# Altium project KIT_DEV.PrjPcb
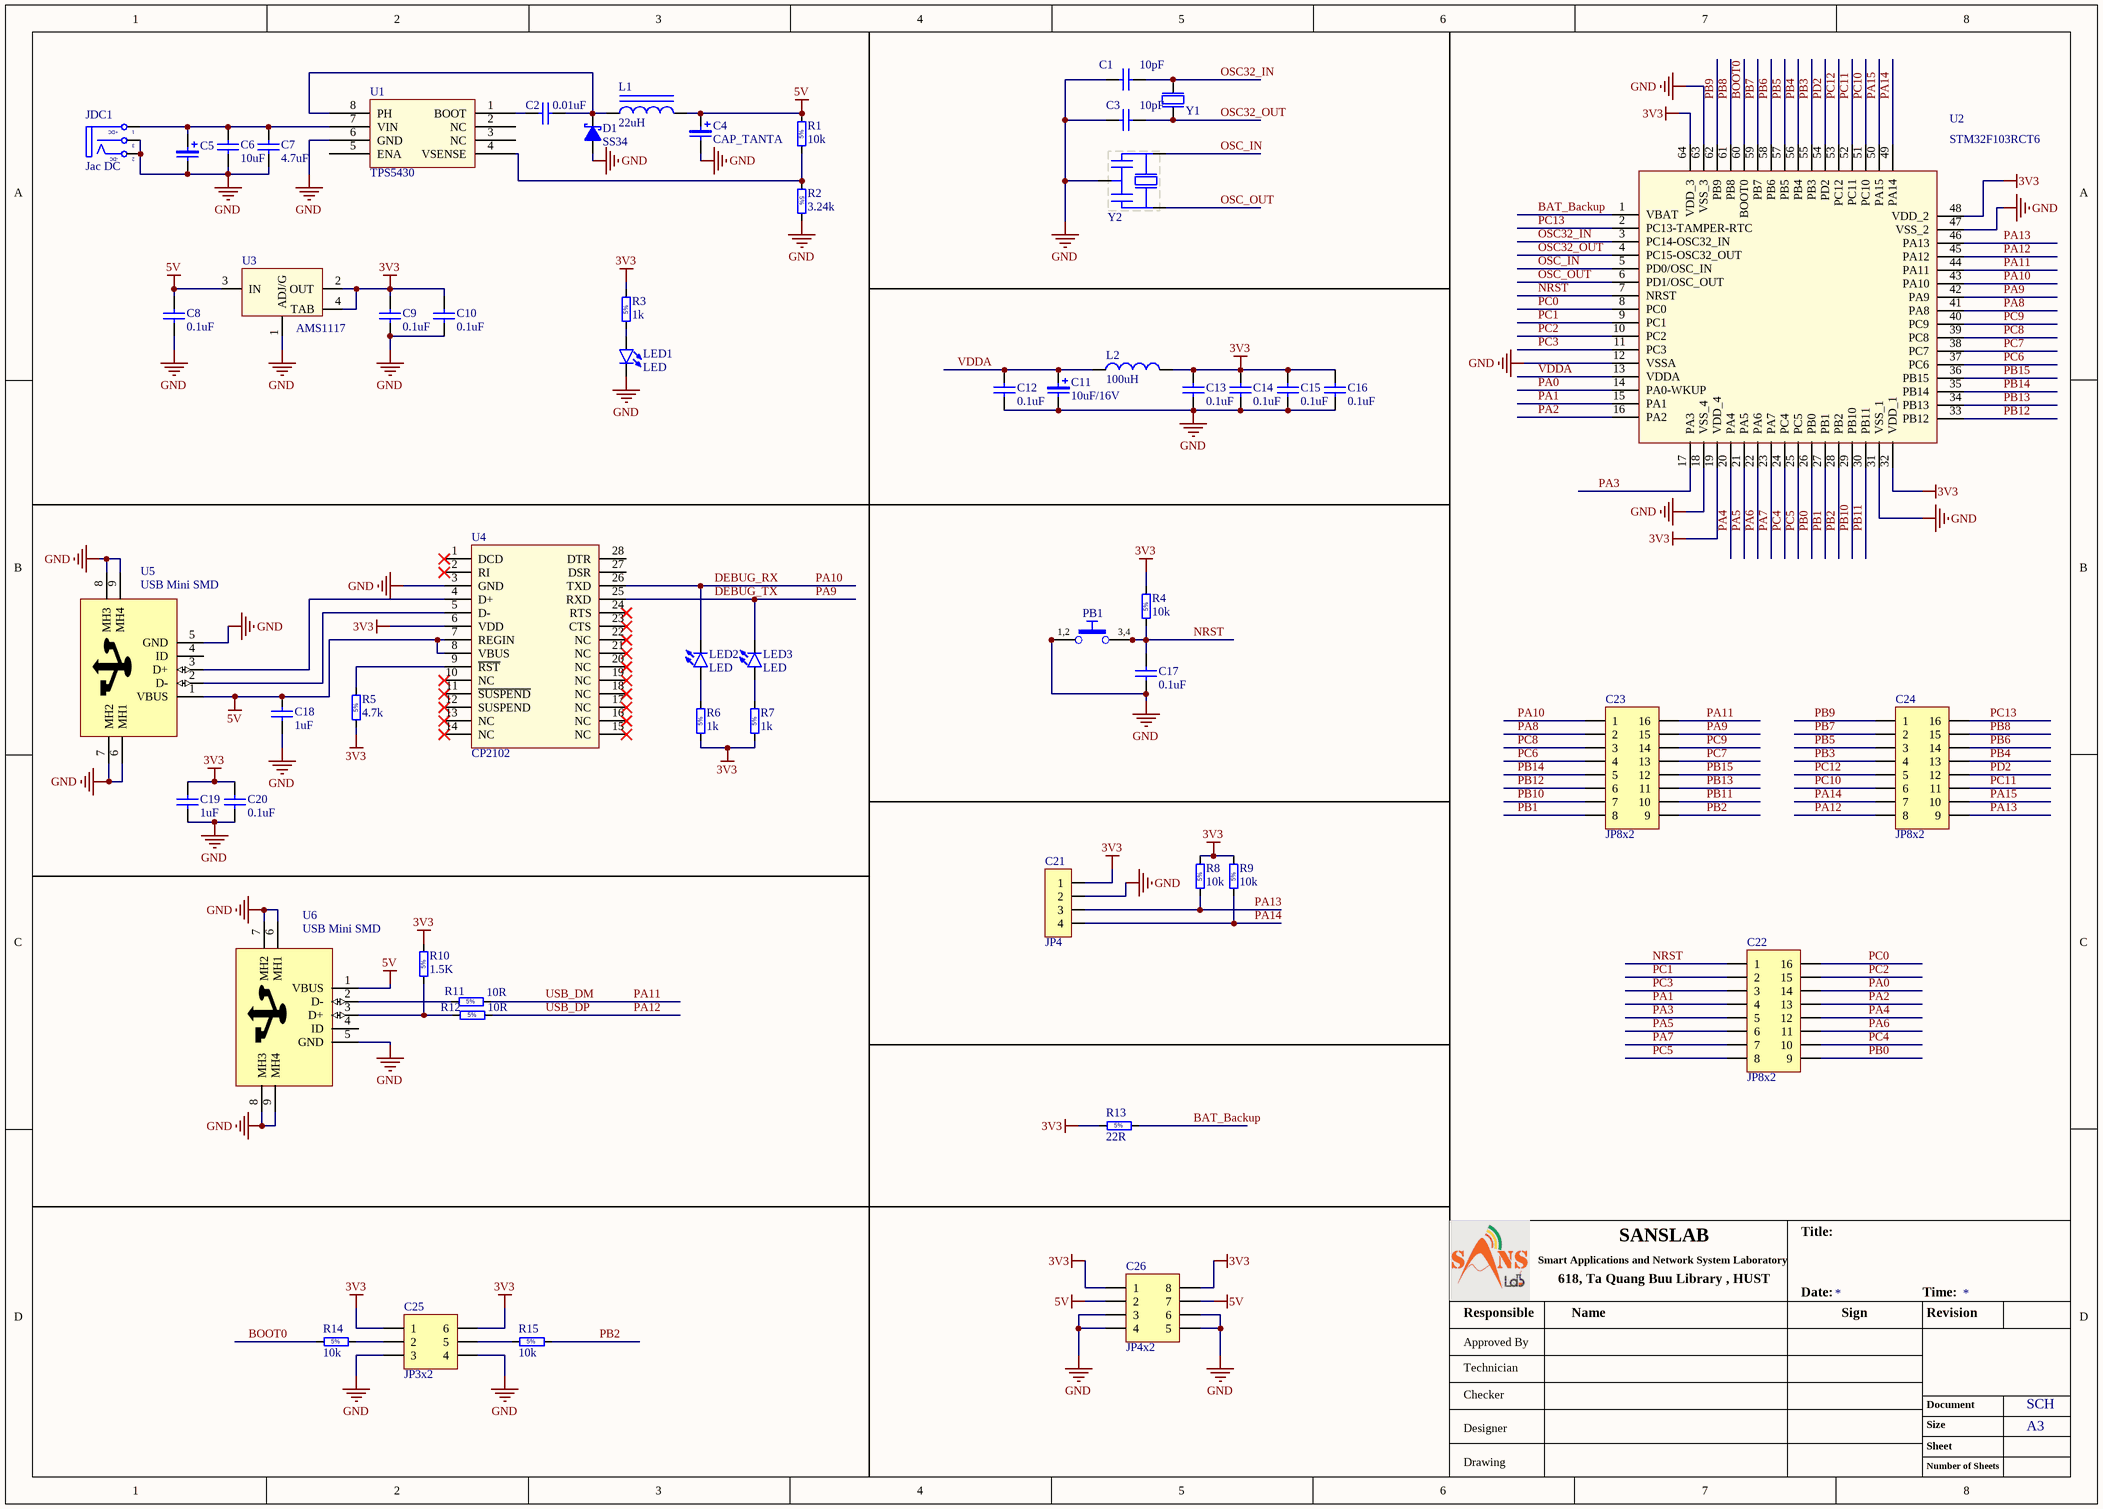
[diagram p0: KIT_STM32.SchDoc]
1 sheet, 57 parts. Net scope: global (net labels, ports and power ports of the same name join across sheets).
Board file: KIT.PcbDoc

## Sheet KIT_STM32.SchDoc
size A3; Organization: Altium Limited; Address1: L3, 12a Rodborough Rd; Address2: Frenchs Forest; Address3: NSW; Address4: Australia 2086

### Parts
C1  10pF  [CAPC1608X87N]
C2  0.01uF  [CAPC1608X06N]
C3  10pF  [CAPC1608X87N]
C4  CAP_TANTA  [Tantalum]
C5  220uF/16V  [CAP_ELEC_6.3]  (value not drawn)
C6  10uF  [CAPC3216X06N]
C7  4.7uF  [CAPC3216X06N]
C8  0.1uF  [CAPC1608X87N]
C9  0.1uF  [CAPC1608X87N]
C10  0.1uF  [CAPC1608X87N]
C11  10uF/16V  [CAPMP_3216_CASE_A]
C12  0.1uF  [CAPC1608X87N]
C13  0.1uF  [CAPC1608X87N]
C14  0.1uF  [CAPC1608X87N]
C15  0.1uF  [CAPC1608X87N]
C16  0.1uF  [CAPC1608X87N]
C17  0.1uF  [CAPC1608X87N]
C18  1uF  [CAPC1608X87N]
C19  1uF  [CAPC1608X87N]
C20  0.1uF  [CAPC1608X87N]
C21  JP4  [JP4-D1C]
C22  JP8x2  [JP8-C2T]
C23  JP8x2  [JP8-C2T]
C24  JP8x2  [JP8-C2T]
C25  JP3x2  [JP3-D2T]
C26  JP4x2  [JP4-D2T]
D1  SS34  [SS34]
JDC1  Jac DC  [DC-IN]
L1  22uH  [INDUCTOR]
L2  100uH  [INDUC_0805_2012X95N]
LED1  LED  [LED-0805-BLUE]
LED2  LED  [LED-0805-BLUE]
LED3  LED  [LED-0805-BLUE]
PB1  Push Button  [PB_TYCO_FSM6JSMA]  (value not drawn)
R1  10k  [RESC1608X55N]
R2  3.24k  [RESC1608X55N]
R3  1k  [RESC1608X55N]
R4  10k  [RESC1608X55N]
R5  4.7k  [RESC1608X55N]
R6  1k  [RESC1608X55N]
R7  1k  [RESC1608X55N]
R8  10k  [RESC1608X55N]
R9  10k  [RESC1608X55N]
R10  1.5K  [RESC1608X55N]
R11  10R  [RESC1608X55N]
R12  10R  [RESC1608X55N]
R13  22R  [RESC1608X55N]
R14  10k  [RESC1608X55N]
R15  10k  [RESC1608X55N]
U1  TPS5430  [TPS5430]
U2  STM32F103RCT6  [QFP50P1000X1000X160-64N]
U3  AMS1117  [AMS1117]
U4  CP2102  [CP2102]
U5  USB Mini SMD  [USB_Montaje]
U6  USB Mini SMD  [USB_Montaje]
Y1  Crystal_2P  [Crystal_2P]  (value not drawn)
Y2  Crystal_4P  [Crystal_4P]  (value not drawn)

### Nets
3V3: C9.1 C10.1 C13.2 C14.2 C15.2 C16.2 C19.2 C20.2 C21.1 C25.1 C25.6 C26.1 C26.8 L2.2 R3.2 R4.2 R5.1 R6.1 R7.1 R8.2 R9.2 R10.2 R13.1 U2.19(VDD_4) U2.32(VDD_1) U2.48(VDD_2) U2.64(VDD_3) U3.2(OUT) U3.4(TAB) U4.6(VDD)
5V: C4.A C8.1 C18.2 C26.2 C26.7 L1.2 R1.2 U3.3(IN) U4.7(REGIN) U4.8(VBUS) U5.1(VBUS) U6.1(VBUS)
GND: C1.1 C3.1 C4.K C5.K C6.1 C7.1 C8.2 C9.2 C10.2 C11.K C12.1 C13.1 C14.1 C15.1 C16.1 C17.1 C18.1 C19.1 C20.1 C21.2 C25.3 C25.4 C26.3 C26.4 C26.5 C26.6 D1.A JDC1.2(TN) JDC1.3(S) LED1.K PB1.1 PB1.2 R2.2 U1.6(GND) U1.9(GND) U2.12(VSSA) U2.18(VSS_4) U2.31(VSS_1) U2.47(VSS_2) U2.63(VSS_3) U3.1(ADJ/G) U4.3(GND) U5.5(GND) U5.6(MH1) U5.7(MH2) U5.8(MH3) U5.9(MH4) U6.5(GND) U6.6(MH1) U6.7(MH2) U6.8(MH3) U6.9(MH4) Y2.2
BAT_Backup: R13.2 U2.1(VBAT)
BOOT0: R14.1 U2.60(BOOT0)
DEBUG_RX: C23.1 LED2.K U2.43(PA10) U4.26(TXD)  [also labelled PA10]
DEBUG_TX: C23.15 LED3.K U2.42(PA9) U4.25(RXD)  [also labelled PA9]
NRST: C17.2 C22.1 PB1.3 PB1.4 R4.1 U2.7(NRST)
OSC32_IN: C1.2 U2.3(PC14-OSC32_IN) Y1.2
OSC32_OUT: C3.2 U2.4(PC15-OSC32_OUT) Y1.1
OSC_IN: U2.5(PD0/OSC_IN) Y2.1
OSC_OUT: U2.6(PD1/OSC_OUT) Y2.3
PA0: C22.14 U2.14(PA0-WKUP)
PA1: C22.4 U2.15(PA1)
PA2: C22.13 U2.16(PA2)
PA3: C22.5 U2.17(PA3)
PA4: C22.12 U2.20(PA4)
PA5: C22.6 U2.21(PA5)
PA6: C22.11 U2.22(PA6)
PA7: C22.7 U2.23(PA7)
PA8: C23.2 U2.41(PA8)
PA11: C23.16 R11.2 U2.44(PA11)  [also labelled USB_DM]
PA12: C24.8 R12.2 U2.45(PA12)  [also labelled USB_DP]
PA13: C21.3 C24.9 R8.1 U2.46(PA13)
PA14: C21.4 C24.7 R9.1 U2.49(PA14)
PA15: C24.10 U2.50(PA15)
PB0: C22.9 U2.26(PB0)
PB1: C23.8 U2.27(PB1)
PB2: C23.9 R15.2 U2.28(PB2)
PB3: C24.4 U2.55(PB3)
PB4: C24.13 U2.56(PB4)
PB5: C24.3 U2.57(PB5)
PB6: C24.14 U2.58(PB6)
PB7: C24.2 U2.59(PB7)
PB8: C24.15 U2.61(PB8)
PB9: C24.1 U2.62(PB9)
PB10: C23.7 U2.29(PB10)
PB11: C23.10 U2.30(PB11)
PB12: C23.6 U2.33(PB12)
PB13: C23.11 U2.34(PB13)
PB14: C23.5 U2.35(PB14)
PB15: C23.12 U2.36(PB15)
PC0: C22.16 U2.8(PC0)
PC1: C22.2 U2.9(PC1)
PC2: C22.15 U2.10(PC2)
PC3: C22.3 U2.11(PC3)
PC4: C22.10 U2.24(PC4)
PC5: C22.8 U2.25(PC5)
PC6: C23.4 U2.37(PC6)
PC7: C23.13 U2.38(PC7)
PC8: C23.3 U2.39(PC8)
PC9: C23.14 U2.40(PC9)
PC10: C24.6 U2.51(PC10)
PC11: C24.11 U2.52(PC11)
PC12: C24.5 U2.53(PC12)
PC13: C24.16 U2.2(PC13-TAMPER-RTC)
PD2: C24.12 U2.54(PD2)
VDDA: C11.A C12.2 L2.1 U2.13(VDDA)
NetC2_1: C2.1 U1.1(BOOT)
NetC2_2: C2.2 D1.K L1.1 U1.8(PH)
NetC5_A: C5.A C6.2 C7.2 JDC1.1(T) U1.7(VIN)
NetC25_2: C25.2 R14.2
NetC25_5: C25.5 R15.1
NetLED1_A: LED1.A R3.1
NetLED2_A: LED2.A R6.2
NetLED3_A: LED3.A R7.2
NetR1_1: R1.1 R2.1 U1.4(VSENSE)
NetR5_2: R5.2 U4.9(~{RST})
NetR10_1: R10.1 R12.1 U6.3(D+)
NetR11_1: R11.1 U6.2(D-)
NetU4_4: U4.4(D+) U5.3(D+)
NetU4_5: U4.5(D-) U5.2(D-)

Not connected (* = marked no-connect by the designer): U1 2(NC) 3(NC) 5(ENA); U4 1(DCD)* 2(RI)* 10(NC)* 11(~{SUSPEND})* 12(SUSPEND)* 13(NC)* 14(NC)* 15(NC)* 16(NC)* 17(NC)* 18(NC)* 19(NC)* 20(NC)* 21(NC)* 22(NC)* 23(CTS)* 24(RTS)* 27(DSR) 28(DTR); U5 4(ID); U6 4(ID)

### Notes on the sheet
- Smart Applications and Network System Laboratory
- SANSLAB
- Title:
- Responsible
- 618, Ta Quang Buu Library , HUST
- Name
- Date:
- Sign
- Time:
- Revision
- Approved By
- Technician
- Checker
- Designer
- Document
- Size
- Sheet
- A3
- SCH
- Drawing
- Number of Sheets
- (in symbol DCIN) +DC; -DC
- (in symbol PB_TYCO_FSM6JSMA) 1,2; 3,4
- (in symbol RC0603FR-071K5L) 5%
- (in symbol RC0603FR-074K7L) 5%
- (in symbol RC0603FR-0710KL) 5%
- (in symbol RC0603JR-7W1KL) 5%
- (in symbol RC0603JR-0722RL) 5%
- (in symbol RC0603JR-07100RL) 5%

### Library data of the parts
C1 C3 = GCM0335C1H100GA16J: Non-polarised capacitor; Part Description: SMD Multilayer Chip Ceramic Capacitor; Manufacturer: Murata Electronics; ID: 13; Voltage: 50VDC; TC: NP0; Tolerance: 10%; Part Number: GCM0335C1H100GA16J; Value: 10pF; Component Kind: Standard; Component Type: Standard; Pin Count: 2; Status: Not Recommended; Manufacturer Part Number: GCM0335C1H100GA16J; Case: 0603; Mounted: Yes; Socket: No; SMD: Yes; ComponentHeigh: https://www.mouser.vn; Manufacturer1 Example: MDBK
C2 = CAP_0603
C5 = Cap Alu: Aluminum Capacitor SMD; Value: 220uF/16V
C6 C7 = CAP_1206
C8-C10 C12-C17 C20 = TMK105B7104KVHF: Non-polarised capacitor; Part Description: SMD Multilayer Chip Ceramic Capacitor; Manufacturer: Taiyo Yuden; ID: 8; Voltage: 25VDC; TC: X7R; Tolerance: 10%; Part Number: TMK105B7104KVHF; Value: 0.1uF; Component Kind: Standard; Component Type: Standard; Pin Count: 2; Status: Not Recommended; Manufacturer Part Number: TMK105B7104KVHF; Case: 0603; Mounted: Yes; Socket: No; SMD: Yes; ComponentHeigh: https://www.mouser.vn; Manufacturer1 Example: MDBK
C11 = Cap Tantalum: Tantalium Capacitor; Value: 10uF/16V
C18 C19 = GRM188R61A105KA61D: Non-polarised capacitor; Part Description: SMD Multilayer Chip Ceramic Capacitor; Manufacturer: Murata Electronics; ID: 9; Voltage: 10VDC; TC: X5R; Tolerance: 10%; Part Number: GRM188R61A105KA61D; Value: 1uF; Component Kind: Standard; Component Type: Standard; Pin Count: 2; Status: Not Recommended; Manufacturer Part Number: GRM188R61A105KA61D; Case: 0603; Mounted: Yes; Socket: No; SMD: Yes; ComponentHeigh: https://www.mouser.vn; Manufacturer1 Example: MDBK
C21 = JP4: WR-PHD 2.54 mm Angled Socket Header; Manufacturer: W¨¹rth Elektronik eiSos GmbH; partNo: 613004143121; ComponentLink1 Description: Manufacturer; ComponentLink2 Description: Datasheet; NoPins: 04; Created Date: 29 March 2013; ComponentLink1URL: http://www.we-online.com; ComponentLink2URL: http://katalog.we-online.de/em/datasheet/6130xx143121.pdf; Created by: Karrer Zheng
C22 C24 = JP8x2: WR-PHD 2.54 mm Dual Socket Header; Manufacturer: W¨¹rth Elektronik eiSos GmbH; partNo: 61301621821; ComponentLink1 Description: Manufacturer; ComponentLink2 Description: Datasheet; NoPins: 16; Created Date: 29 March 2013; ComponentLink1URL: http://www.we-online.com; ComponentLink2URL: http://katalog.we-online.de/em/datasheet/6130xx21821.pdf; Created by: Karrer Zheng
C23 = JP8x2: WR-PHD 2.54 mm Dual Socket Header; Manufacturer: W¨¹rth Elektronik eiSos GmbH; partNo: 61301621821; ComponentLink1 Description: Manufacturer; ComponentLink2 Description: Datasheet; NoPins: 16; System: Connector; Created Date: 29 March 2013; ComponentLink1URL: http://www.we-online.com; ComponentLink2URL: http://katalog.we-online.de/em/datasheet/6130xx21821.pdf; Created by: Karrer Zheng
C25 = JP3x2: WR-PHD 2.54 mm Dual Socket Header; Manufacturer: W¨¹rth Elektronik eiSos GmbH; partNo: 61300621821; ComponentLink1 Description: Manufacturer; ComponentLink2 Description: Datasheet; NoPins: 06; Created Date: 29 March 2013; ComponentLink1URL: http://www.we-online.com; ComponentLink2URL: http://katalog.we-online.de/em/datasheet/6130xx21821.pdf; Created by: Karrer Zheng
C26 = JP4x2: WR-PHD 2.54 mm Dual Socket Header; Manufacturer: W¨¹rth Elektronik eiSos GmbH; partNo: 61300821821; ComponentLink1 Description: Manufacturer; ComponentLink2 Description: Datasheet; NoPins: 08; Created Date: 29 March 2013; ComponentLink1URL: http://www.we-online.com; ComponentLink2URL: http://katalog.we-online.de/em/datasheet/6130xx21821.pdf; Created by: Karrer Zheng
JDC1 = DCIN: Jac DC input; Value: Jac DC
L1 = INDUCTOR
L2 = INDUCTOR_0805
LED1-LED3 = LED_0805
PB1 = PB_TYCO_FSM6JSMA: Push-Button Switch SPDT; Part Description: 12VDC 50mA SPST Tactile  Push-Button Switch; Manufacturer: TYCO ELECTRONICS; Manufacturer Part Number: FSM6JSMA or  4-1437565-9; Table: Switches; Part Number: PB_TYCO_FSM6JSMA; Component Kind: Standard; Component Type: Standard; Pin Count: 4; PackageDescription: Body 6mm x 6mm, Surface Mount Tactile Switches, TYCO ALCOSWITCH FSMJSMA Series; Family: Push Button; Mounted: Yes; Socket: No; SMD: Yes; Status: None; ComponentHeight: 7.11mm; HelpURL: \\cern.ch\dfs\Applications\Altium\Datasheets\PB_TYCO_FSM6JSMA.pdf; Author: CERN DEM JLC; CreateDate: 6/21/2012; LatestRevisionDate: 6/21/2012
R1 R4 R8 R9 R14 R15 = RC0603FR-0710KL: Resistor - 5%; Part Description: General Purpose Chip Resistor; Manufacturer: Yageo; ID: 3; Power: 100 mW; TC: ±100ppm/°C; Part Number: RC0603FR-0710KL; Value: 10k; Component Kind: Standard; Component Type: Standard; Pin Count: 2; Status: Not recommended; Tolerance: ±5%; Manufacturer Part Number: RC0603FR-0710KL; Case: 0603; Mounted: Yes; Socket: No; SMD: Yes; Author: MDBK; HelpURL: https://www.mouser.vn/
R2 R5 = RC0603FR-074K7L: Resistor - 5%; Part Description: General Purpose Chip Resistor; Manufacturer: Yageo; ID: 4; Power: 100 mW; TC: ±100ppm/°C; Part Number: RC0603FR-074K7L; Component Kind: Standard; Component Type: Standard; Pin Count: 2; Status: Not recommended; Tolerance: ±5%; Manufacturer Part Number: RC0603FR-074K7L; Case: 0603; Mounted: Yes; Socket: No; SMD: Yes; Author: MDBK; HelpURL: https://www.mouser.vn/
  R2: Value: 3.24k
  R5: Value: 4.7k
R3 R6 R7 = RC0603JR-7W1KL: Resistor - 5%; Part Description: General Purpose Chip Resistor; Manufacturer: Yageo; ID: 6; Power: 100 mW; TC: ±100ppm/°C; Part Number: RC0603JR-7W1KL; Value: 1k; Component Kind: Standard; Component Type: Standard; Pin Count: 2; Status: Not recommended; Tolerance: ±5%; Manufacturer Part Number: RC0603JR-7W1KL; Case: 0603; Mounted: Yes; Socket: No; SMD: Yes; Author: MDBK; HelpURL: https://www.mouser.vn/
R10 = RC0603FR-071K5L: Resistor - 5%; Part Description: General Purpose Chip Resistor; Manufacturer: Yageo; ID: 8; Power: 100 mW; TC: ±100ppm/°C; Part Number: RC0603FR-071K5L; Value: 1.5K; Component Kind: Standard; Component Type: Standard; Pin Count: 2; Status: Not recommended; Tolerance: ±5%; Manufacturer Part Number: RC0603FR-071K5L; Case: 0603; Mounted: Yes; Socket: No; SMD: Yes; Author: MDBK; HelpURL: https://www.mouser.vn/
R11 R12 = RC0603JR-07100RL: Resistor - 5%; Part Description: General Purpose Chip Resistor; Manufacturer: Yageo; ID: 12; Power: 100 mW; TC: ±100ppm/°C; Part Number: RC0603JR-07100RL; Value: 10R; Component Kind: Standard; Component Type: Standard; Pin Count: 2; Status: Not recommended; Tolerance: ±5%; Manufacturer Part Number: RC0603JR-07100RL; Case: 0603; Mounted: Yes; Socket: No; SMD: Yes; Author: MDBK; HelpURL: https://www.mouser.vn/
R13 = RC0603JR-0722RL: Resistor - 5%; Part Description: General Purpose Chip Resistor; Manufacturer: Yageo; ID: 11; Power: 100 mW; TC: ±100ppm/°C; Part Number: RC0603JR-0722RL; Value: 22R; Component Kind: Standard; Component Type: Standard; Pin Count: 2; Status: Not recommended; Tolerance: ±5%; Manufacturer Part Number: RC0603JR-0722RL; Case: 0603; Mounted: Yes; Socket: No; SMD: Yes; Author: MDBK; HelpURL: https://www.mouser.vn/
U2 = STM32F103RCT6-64: MPN: STM32F103RCT6; OC_FARNELL: 1624136; OC_NEWARK: 01P4099; PACKAGE: QFP-64; SUPPLIER: STMICROELECTRONICS
U3 = LM1117
U5 U6 = USB Mini SMD: USB, MINI, SMD,  Molex